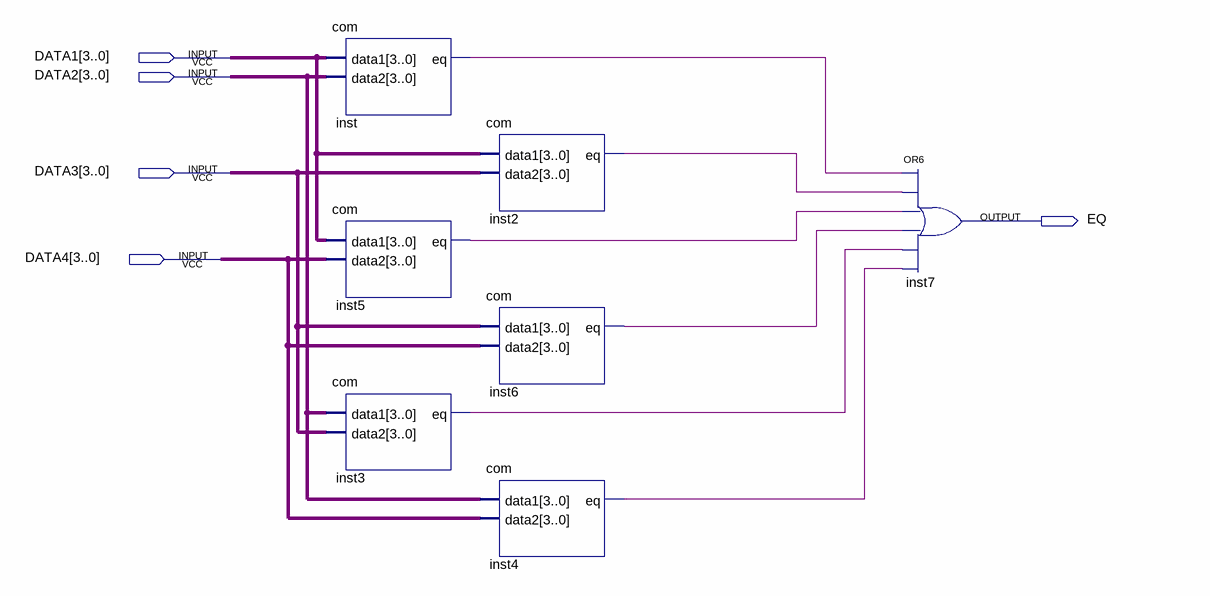
[diagram p0: schematic sheet]
// Quartus schematic four_data_com.bdf as structural Verilog: 7 symbols, 5 pins
module four_data_com (
  input  [3:0] DATA1,
  input  [3:0] DATA2,
  input  [3:0] DATA3,
  input  [3:0] DATA4,
  output EQ
);

  wire inst2_eq, inst3_eq, inst4_eq, inst5_eq, inst6_eq, inst_eq;

  com inst (.data1(DATA1), .data2(DATA2), .eq(inst_eq));
  com inst5 (.data1(DATA1), .data2(DATA4), .eq(inst5_eq));
  com inst3 (.data1(DATA2), .data2(DATA3), .eq(inst3_eq));
  com inst2 (.data1(DATA1), .data2(DATA3), .eq(inst2_eq));
  com inst6 (.data1(DATA3), .data2(DATA4), .eq(inst6_eq));
  com inst4 (.data1(DATA2), .data2(DATA4), .eq(inst4_eq));
  or inst7 (EQ, inst_eq, inst2_eq, inst5_eq, inst6_eq, inst3_eq, inst4_eq);
endmodule
